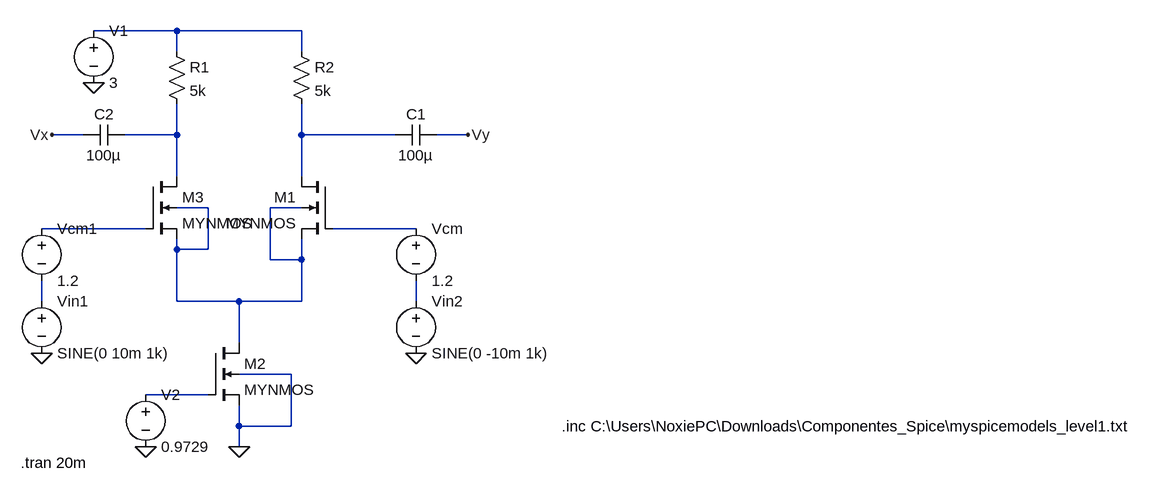
[diagram p0: schematic circuito1.asc]
circuito1.asc, the LTspice schematic file:
Version 4.1
SHEET 1 1188 680
WIRE -368 -464 -496 -464
WIRE -176 -464 -368 -464
WIRE -368 -432 -368 -464
WIRE -176 -432 -176 -464
WIRE -512 -304 -560 -304
WIRE -368 -304 -368 -352
WIRE -368 -304 -448 -304
WIRE -176 -304 -176 -352
WIRE -32 -304 -176 -304
WIRE 80 -304 32 -304
WIRE -368 -240 -368 -304
WIRE -176 -240 -176 -304
WIRE -320 -192 -368 -192
WIRE -176 -192 -224 -192
WIRE -416 -160 -576 -160
WIRE 0 -160 -128 -160
WIRE -368 -128 -368 -144
WIRE -320 -128 -320 -192
WIRE -320 -128 -368 -128
WIRE -224 -112 -224 -192
WIRE -176 -112 -176 -144
WIRE -176 -112 -224 -112
WIRE -576 -48 -576 -80
WIRE -368 -48 -368 -128
WIRE -272 -48 -368 -48
WIRE -176 -48 -176 -112
WIRE -176 -48 -272 -48
WIRE 0 -48 0 -80
WIRE -272 16 -272 -48
WIRE -192 64 -272 64
WIRE -320 96 -416 96
WIRE -272 144 -272 112
WIRE -192 144 -192 64
WIRE -192 144 -272 144
WIRE -272 176 -272 144
FLAG -496 -384 0
FLAG -272 176 0
FLAG -416 176 0
FLAG -576 32 0
FLAG 0 32 0
FLAG 80 -304 Vy
FLAG -560 -304 Vx
SYMBOL voltage -496 -480 R0
WINDOW 123 0 0 Left 0
WINDOW 39 0 0 Left 0
SYMATTR InstName V1
SYMATTR Value 3
SYMBOL res -384 -448 R0
SYMATTR InstName R1
SYMATTR Value 5k
SYMBOL res -192 -448 R0
SYMATTR InstName R2
SYMATTR Value 5k
SYMBOL nmos4 -320 16 R0
SYMATTR InstName M2
SYMATTR Value MYNMOS
SYMATTR Value2 l=0.5u w=50u
SYMBOL nmos4 -416 -240 R0
SYMATTR InstName M3
SYMATTR Value MYNMOS
SYMATTR Value2 l=0.5u w=50u
SYMBOL nmos4 -128 -240 M0
SYMATTR InstName M1
SYMATTR Value MYNMOS
SYMATTR Value2 l=0.5u w=50u
SYMBOL voltage -416 80 R0
WINDOW 123 0 0 Left 0
WINDOW 39 0 0 Left 0
SYMATTR InstName V2
SYMATTR Value 0.9729
SYMBOL voltage 0 -176 R0
WINDOW 123 0 0 Left 0
WINDOW 39 0 0 Left 0
SYMATTR InstName Vcm
SYMATTR Value 1.2
SYMBOL voltage -576 -176 R0
WINDOW 123 0 0 Left 0
WINDOW 39 0 0 Left 0
SYMATTR InstName Vcm1
SYMATTR Value 1.2
SYMBOL voltage -576 -64 R0
WINDOW 123 0 0 Left 0
WINDOW 39 0 0 Left 0
SYMATTR InstName Vin1
SYMATTR Value SINE(0 10m 1k)
SYMBOL voltage 0 -64 R0
WINDOW 123 0 0 Left 0
WINDOW 39 0 0 Left 0
SYMATTR InstName Vin2
SYMATTR Value SINE(0 -10m 1k)
SYMBOL cap 32 -320 R90
WINDOW 0 0 32 VBottom 2
WINDOW 3 32 32 VTop 2
SYMATTR InstName C1
SYMATTR Value 100µ
SYMBOL cap -448 -320 R90
WINDOW 0 0 32 VBottom 2
WINDOW 3 32 32 VTop 2
SYMATTR InstName C2
SYMATTR Value 100µ
TEXT 224 144 Left 2 !.inc C:\\Users\\NoxiePC\\Downloads\\Componentes_Spice\\myspicemodels_level1.txt
TEXT -608 200 Left 2 !.tran 20m

The netlist it stands for:
* circuito1.asc
V1 N001 0 3
R1 N001 N002 5k
R2 N001 N003 5k
M2 N004 N009 0 0 MYNMOS l=0.5u w=50u
M3 N002 N005 N004 N004 MYNMOS l=0.5u w=50u
M1 N003 N006 N004 N004 MYNMOS l=0.5u w=50u
V2 N009 0 0.9729
Vcm N006 N008 1.2
Vcm1 N005 N007 1.2
Vin1 N007 0 SINE(0 10m 1k)
Vin2 N008 0 SINE(0 -10m 1k)
C1 Vy N003 100µ
C2 N002 Vx 100µ
.model NMOS NMOS
.model PMOS PMOS
.lib standard.mos
.inc C:\Users\NoxiePC\Downloads\Componentes_Spice\myspicemodels_level1.txt
.tran 20m
.backanno
.end